# EAGLE design PCA9306_Breakout (EAGLE 6.4)
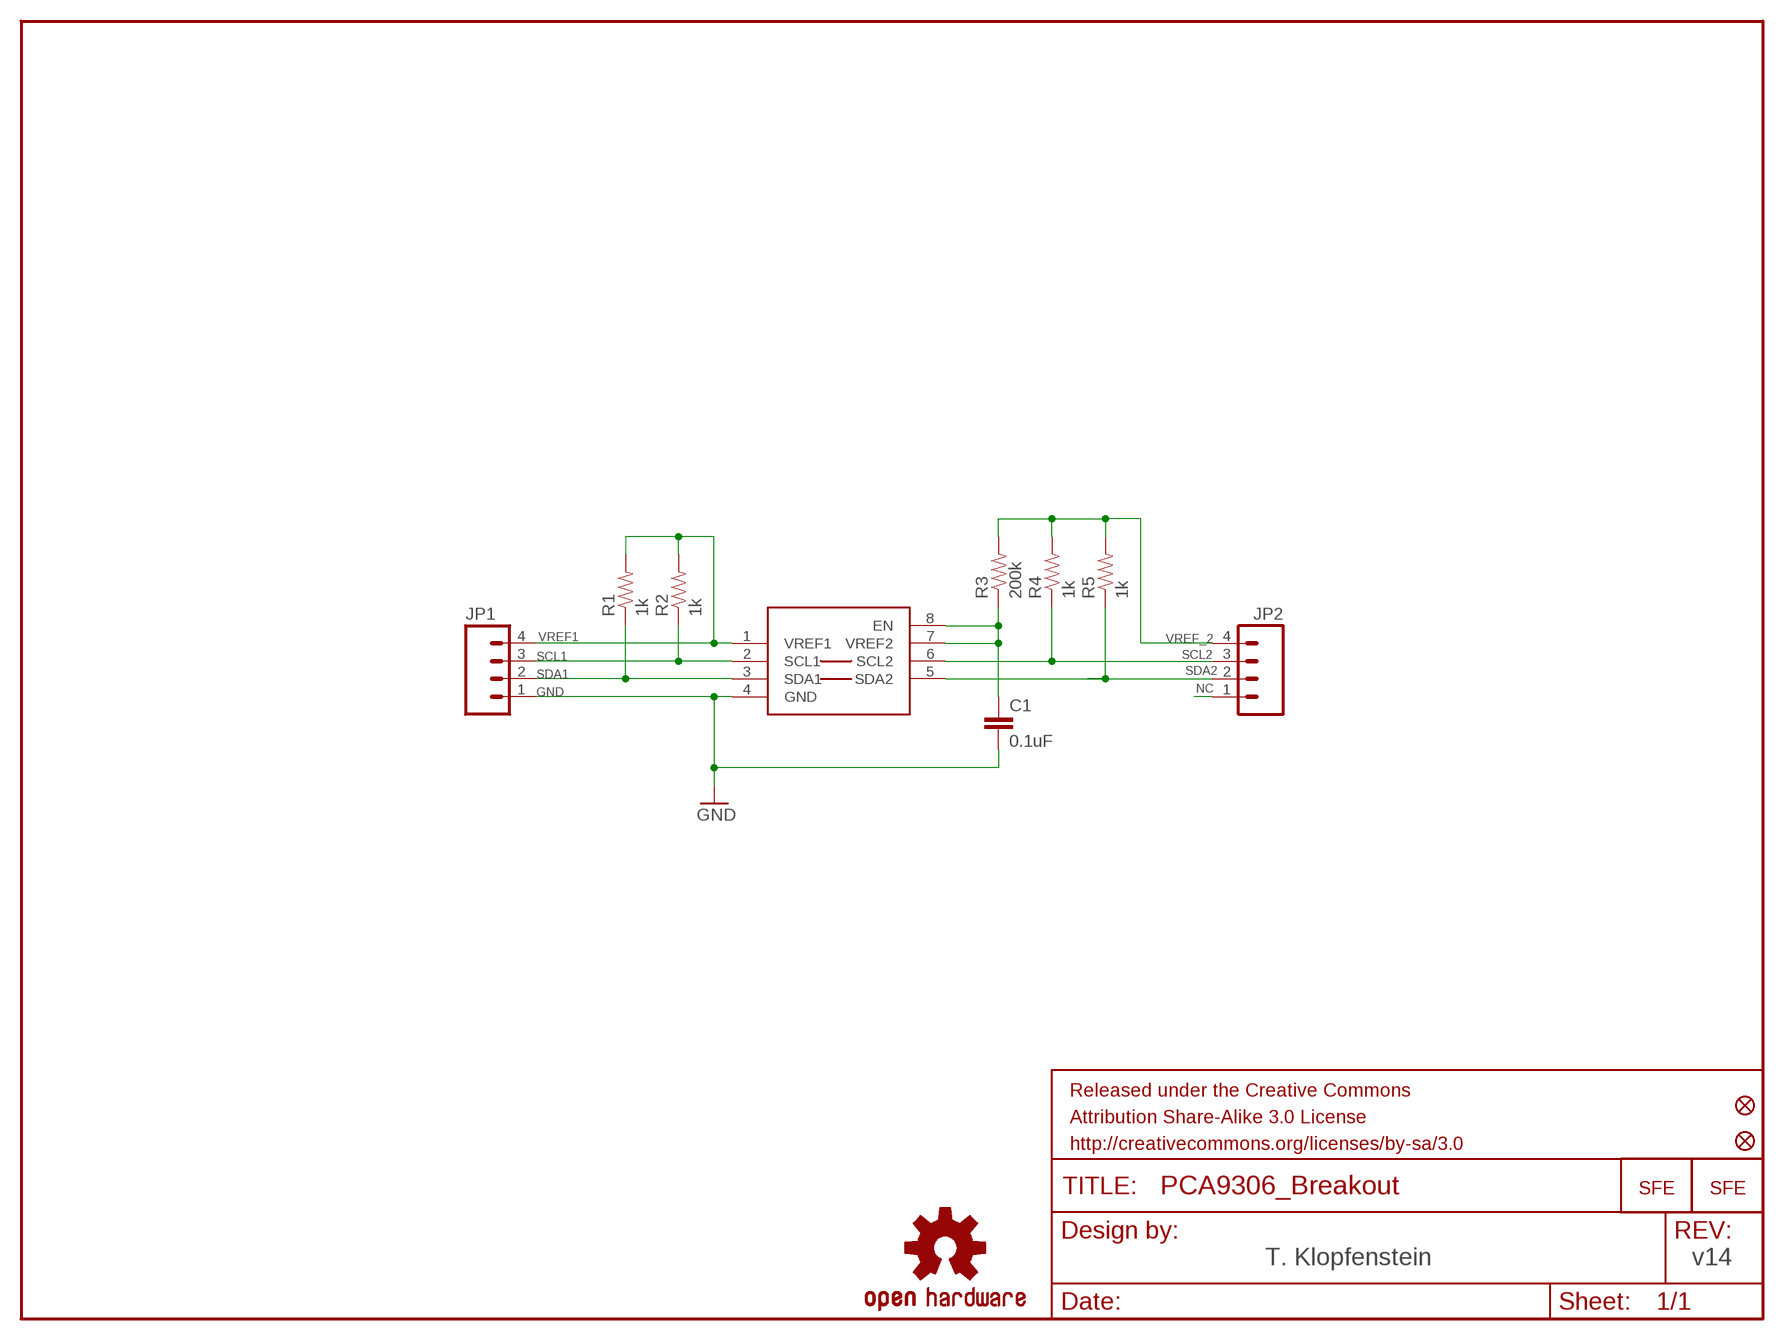
[diagram p0: schematic, sheet 1]

## Parts
C1  0.1uF  CAP0603-CAP  [0603-CAP]
FRAME1  FRAME-LETTER  [CREATIVE_COMMONS]
JP1  M04PTH  [1X04]
JP2  M04PTH  [1X04]
JP3  LOGO-SFESK  [SFE-LOGO-FLAME]
JP4  LOGO-SFESK  [SFE-LOGO-FLAME]
JP7  FIDUCIAL1X2.5  [FIDUCIAL-1X2.5]
JP8  FIDUCIAL1X2.5  [FIDUCIAL-1X2.5]
LOGO1  OSHW-LOGOS  [OSHW-LOGO-S]
R1  1k  RESISTOR0603-RES  [0603-RES]
R2  1k  RESISTOR0603-RES  [0603-RES]
R3  200k  RESISTOR0603-RES  [0603-RES]
R4  1k  RESISTOR0603-RES  [0603-RES]
R5  1k  RESISTOR0603-RES  [0603-RES]
U$1  PCA9306  [PSOP-8]

## Nets
GND: C1.2 JP1.1 U$1.4(GND)
NC: JP2.1
SCL1: JP1.3 R2.1 U$1.2(SCL1)
SCL2: JP2.3 R4.1 U$1.6(SCL2)
SDA1: JP1.2 R1.1 U$1.3(SDA1)
SDA2: JP2.2 R5.1 U$1.5(SDA2)
VREF1: JP1.4 R1.2 R2.2 U$1.1(VREF1)
VREF2: C1.1 R3.1 U$1.7(VREF2) U$1.8(EN)
VREF_2: JP2.4 R3.2 R4.2 R5.2

## Notes on the sheet
- T. Klopfenstein | v14

## Library data of the parts
C1 = SparkFun:CAP: Capacitor Standard 0603 ceramic capacitor, and 0.1" leaded capacitor.
FRAME1 = SparkFun-Aesthetics:FRAME-LETTER: Schematic Frame Standard 8.5x11 US Letter frame
JP1 JP2 = SparkFun:M04: Header 4 Standard 4-pin 0.1" header. Use with straight break away headers (SKU : PRT-00116), right angle break away headers (PRT-00553), swiss pins (PRT-00743), machine pins (PRT-00117), and female headers (PRT-00115). Molex polarized connector foot print use with SKU : PRT-08231 with associated crimp pins and housings.
JP3 JP4 = SparkFun:LOGO-SFE: Spark Fun Electronics PCB Logo This is the standard Spark Fun Electronics PCB logo.
JP7 JP8 = abes:FIDUCIAL: Fiducial Alignment Points Various fiducial points for machine vision alignment.
LOGO1 = SparkFun-Aesthetics:OSHW-LOGO: Open Source Hardware Logo This logo indicates the piece of hardware it is found on incorporates a OSHW license and/or adheres to the definition of open source hardware found here: http://freedomdefined.org/OSHW
R1-R5 = SparkFun:RESISTOR: Resistor Basic schematic elements and footprints for 0603, 1206, and PTH resistors.
U$1 = miscellany:PCA9306

## Board
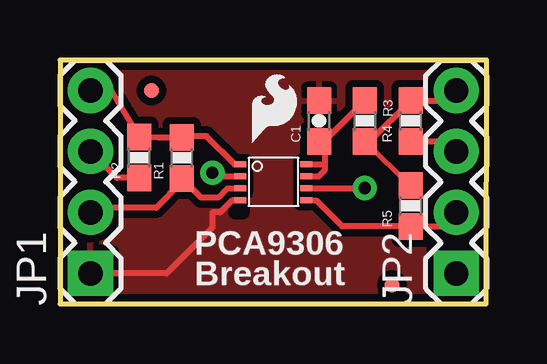
[diagram p1: board, top side]
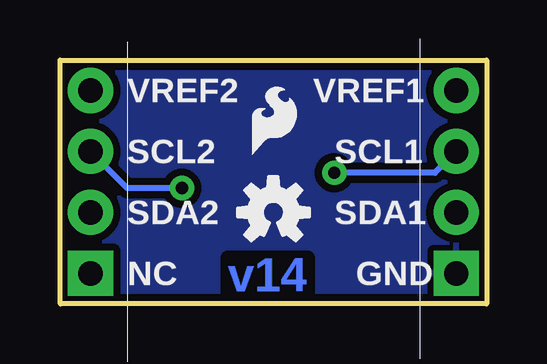
[diagram p2: board, bottom side, seen from below]

Size 17.78 x 10.16 mm. Coordinates in mm from the lower left corner, seen from the top.
Outline: 0,0 17.76,0 17.78,10.16 0,10.16 0,0
Copper layers (1*16): Top 0.035mm / dielectric 1.5mm / Bottom 0.035mm
Design rules "SparkFun": minimum track width 8mil, minimum drill 20mil, track to track 8mil, track to pad 8mil, pad to pad 8mil, via to via 8mil, smd to smd 8mil, copper to edge 8mil, drill to drill 8mil, minimum pad ring 12mil, minimum via ring 10mil, stop-mask expansion 4mil, vias tented up to drill 20mil, thermal gap 10mil
tRestrict: area 7.3,3.8 to 7.6,4.1

### Footprints (pad centres in the part's own frame; a part is rotated, then mirrored left to right if it is on the bottom)
0603-CAP = smd 1.1 x 1: 1 -0.85,0; 2 0.85,0
1X04 = drill 1.016 pad 1.88 square: 1 0,0 | drill 1.016 pad 1.88: 2 2.54,0; 3 5.08,0; 4 7.62,0
FIDUCIAL-1X2.5 = smd 0.635 x 0.635: 1 0,0
0603-RES = smd 1.1 x 1: 1 -0.85,0; 2 0.85,0
PSOP-8 = smd 0.25 x 0.5: 1 -0.73,-1.37; 2 -0.23,-1.37; 3 0.27,-1.37; 4 0.77,-1.37; 5 0.77,1.38; 6 0.27,1.38; 7 -0.23,1.38; 8 -0.73,1.38

### Placement (x,y rotation side)
C1  10.79,7.62 90 top
FRAME1  -4.94,-10.16 0 top  (outside the outline)
JP1  1.27,1.27 90 top
JP2  16.51,1.27 90 top
JP3  8,6.73 0 top
JP4  9.78,6.22 0 bottom
JP7  3.81,8.89 0 top
JP8  13.84,0.79 0 top
LOGO1  8.89,3.81 0 bottom
R1  5.08,6.08 90 top
R2  3.3,6.1 90 top
R3  12.7,7.62 270 top
R4  14.61,7.62 90 top
R5  14.61,4.08 90 top
U$1  8.89,5.08 270 top

### Tracks (layer width: path | path; a pad name or v marks a point on that pad's centre or on a via)
GND
  Top 0.254: U$1.4 7.17,4.31 6.67,3.81 6.35,3.81 6.35,3.17 4.45,1.27 JP1.1
  pour Bottom (isolate 0.305): 0,10.16 17.78,10.16 17.78,0 0,0
  pour Top (isolate 0.305): 0,10.16 17.78,10.16 17.78,0 0,0
SCL1  (via drill 0.51)
  Top 0.254: U$1.2 6.5,5.31 v6.35,5.46 | R2.1 2.37,5.25 JP1.3
  Bottom 0.254: v6.35,5.46 2.16,5.46 JP1.3
SCL2  (via drill 0.51)
  Top 0.254: R4.1 16.09,6.77 JP2.3 | U$1.6 12.68,4.81 v12.7,4.83
  Bottom 0.254: v12.7,4.83 14.99,4.83 JP2.3
SDA1
  Top 0.254: U$1.3 6.97,4.81 6.59,4.43 5.88,4.43 R1.1 5.08,5.08 4,4 1.46,4 JP1.2
SDA2
  Top 0.254: JP2.2 15.93,3.23 R5.1 11.76,3.23 10.68,4.31 U$1.5
VREF1
  Top 0.254: JP1.4 2.12,8.89 R2.2 4.08,6.93 R1.2 5.13,6.99 6.1,6.99 7.27,5.81 U$1.1
VREF2
  Top 0.254: R3.1 11,6.77 C1.1 11.05,6.52 11.05,5.71 | U$1.8 10.95,5.81 11.05,5.71 | U$1.7 10.77,5.31 11.05,5.59 11.05,5.71
VREF_2
  Top 0.203: R3.2 R5.2
  Top 0.254: R3.2 12.9,6.77 R4.2 16.09,8.47 JP2.4

### Text on the board
Bottom: v14
tPlace: PCA9306 | Breakout
bPlace: VREF1 | VREF2 | SCL1 | SCL2 | SDA1 | SDA2 | GND | NC
tValues: T. Klopfenstein